# Altium project PressureSensor_SWS.PrjPcb
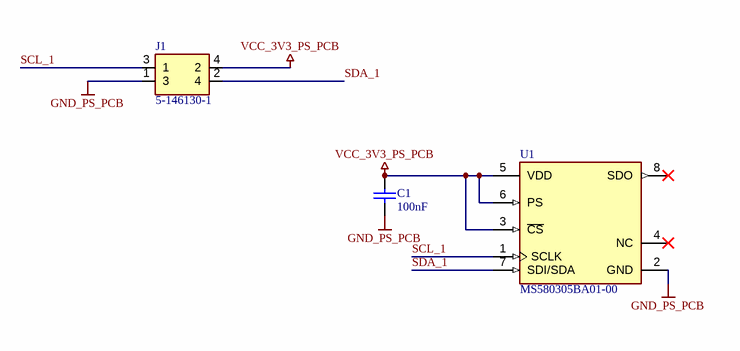
[diagram p0: PressureSensor_PCB.SchDoc]
1 sheet, 3 parts. Net scope: global (net labels, ports and power ports of the same name join across sheets).
Board file: PressureSensor.PcbDoc

## Sheet PressureSensor_PCB.SchDoc: PressureSensor PCB
size A3; DrawnBy: Fekunz; Revision: 1; SheetNumber: 1; SheetTotal: 1

### Parts
C1  100nF  [CAPC2013X140X50NL20T25]
J1  5-146130-1  [TE_5-146130-1]
U1  MS580305BA01-00  [FP-MS580301BA01-00-MFG]

### Nets
GND_PS_PCB: C1.1 J1.1(3) U1.2(GND)
VCC_3V3_PS_PCB: C1.2 J1.4(2) U1.3(~{CS}) U1.5(VDD) U1.6(PS)
SCL_1: J1.3(1) U1.1(SCLK)
SDA_1: J1.2(4) U1.7(SDI/SDA)

Not connected (* = marked no-connect by the designer): U1 4(NC)* 8(SDO)*

### Notes on the sheet
- Project:
- Drawn by:
- Size:
- Sheet
- A3
- Rev.:
- of
- Date:
- File:

### Library data of the parts
C1 = CMP-2007-04629-1: Part Number: 08055C104K4Z2A; Manufacturer: AVX Interconnect / Elco
J1 = 5-146130-1: AMPMODU 4 Position Surface Mount Dual Row Straight 2.54 mm Breakaway Header; MF: {'manufacturer': u'TE Connectivity'}; Price: None; Package: None; Availability: Unavailable; Value: *; MP: 5-146130-1
U1 = CMP-03338-000001-1: MINIATURE ALTIMETER MODULE; Manufacturer Part Number: MS580301BA01-00; Manufacturer: TE Connectivity; Port Style: No Port; Min Supply Voltage: 1.8V; Response Time: 8.22ms; Sensor Output: I2C,SPI; Max Supply Voltage: 3.6V; Standoff Height: 0.1mm; Operating Supply Current: 0.9-12.5uA; Device Class L1: Sensors; Mouser Description: MS5803-01BA Series 3 V 1 to 130 kPa Miniature Variometer Module; Temperature Range High: +85°C; Temperature: -40°C to +85°C; Category: IC; Device Class L3: unset; Device Class L2: Pressure Sensors; RoHS: TRUE; ComponentLink2Description: Datasheet; Automotive: No; Temperature Range Low: -40°C; Package: 0; Lead Free: Yes; Octopart: https://octopart.com/ms580301ba01-00-te+connectivity-59208927; Height: 3.33mm; Digikey Description: MINIATURE ALTIMETER MODULE; ComponentLink2URL: https://www.te.com/commerce/DocumentDelivery/DDEController?Action=showdoc&DocId=Data+Sheet%7FMS5803-01BA%7FB3%7Fpdf%7FEnglish%7FENG_DS_MS5803-01BA_B3.pdf%7FMS580301BA01-00